# EasyEDA Pro project New Project_2025-06-11_12-14-33.eprj

# Schematic Schematic1
Board Name: Board1; Create Date: 2025-06-11; Page Name: P1; Project Name: New Project_2025-06-11_12-14-33; Schematic Name: Schematic1; Update Date: 2025-06-11; Company: EasyEDA.com; Page Size: A4; Version: V1.0
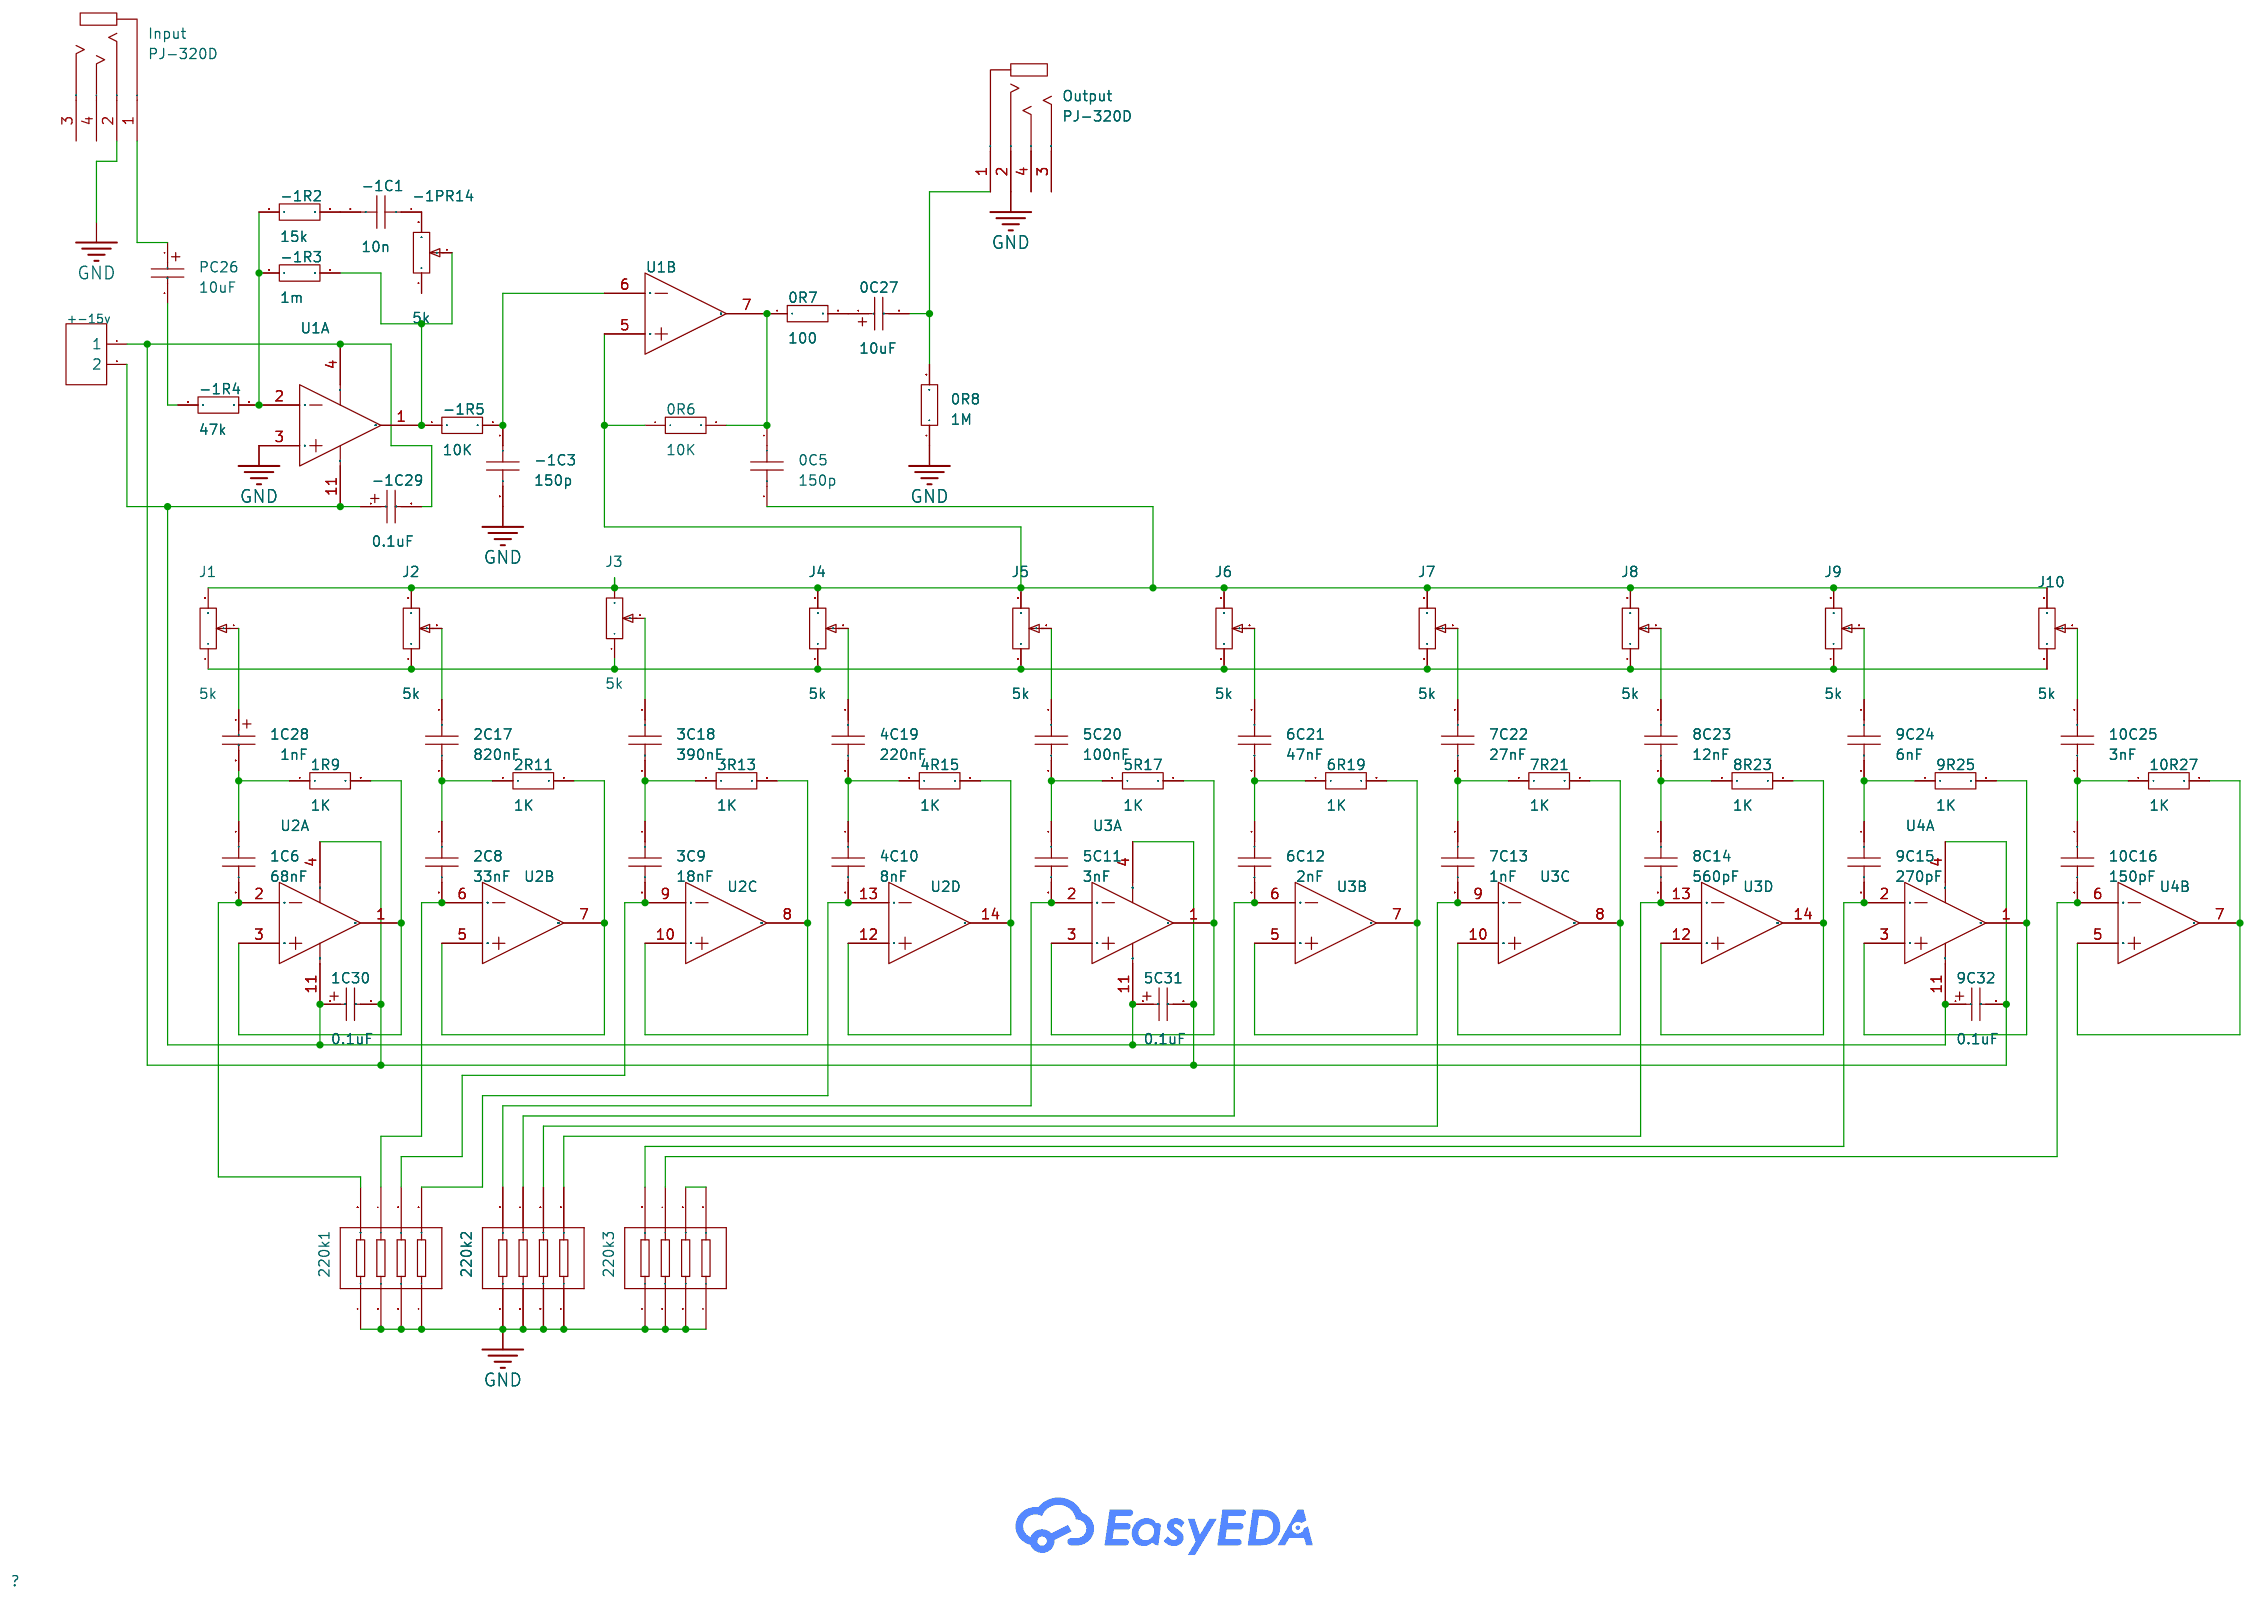
[diagram p0: schematic sheet]

## Parts
0C5  150p  [C0603]
0C27  10uF  [CAP-SMD_BD3.0-L3.3-W3.3-RD]
0R6  10K  [R0603]
0R7  100  [R0603]
0R8  1M  [R0603]
1C6  68nF  [C0603]
1C28  1nF  [CAP-SMD_BD3.0-L3.3-W3.3-RD]
1C30  0.1uF  [CAP-SMD_BD3.0-L3.3-W3.3-RD]
1R9  1K  [R0603]
2C8  33nF  [C0603]
2C17  820nF  [C0603]
2R11  1K  [R0603]
3C9  18nF  [C0603]
3C18  390nF  [C0603]
3R13  1K  [R0603]
4C10  8nF  [C0603]
4C19  220nF  [C0603]
4R15  1K  [R0603]
5C11  3nF  [C0603]
5C20  100nF  [C0603]
5C31  0.1uF  [CAP-SMD_BD3.0-L3.3-W3.3-RD]
5R17  1K  [R0603]
6C12  2nF  [C0603]
6C21  47nF  [C0603]
6R19  1K  [R0603]
7C13  1nF  [C0603]
7C22  27nF  [C0603]
7R21  1K  [R0603]
8C14  560pF  [C0603]
8C23  12nF  [C0603]
8R23  1K  [R0603]
9C15  270pF  [C0603]
9C24  6nF  [C0603]
9C32  0.1uF  [CAP-SMD_BD3.0-L3.3-W3.3-RD]
9R25  1K  [R0603]
10C16  150pF  [C0603]
10C25  3nF  [C0603]
10R27  1K  [R0603]
220k1  220K  [RES-ARRAY-SMD_0603-8P-L3.2-W1.6-BL]
220k2  220K  [RES-ARRAY-SMD_0603-8P-L3.2-W1.6-BL]
220k3  220K  [RES-ARRAY-SMD_0603-8P-L3.2-W1.6-BL]
+-15v  -  [HDR-TH_2P-P2.54-V-F]
-1C1  10n  [C0603]
-1C3  150p  [C0603]
-1C29  0.1uF  [CAP-SMD_BD3.0-L3.3-W3.3-RD]
-1PR14  5k  [RES-ADJ-TH_3P-L9.5-W9.5-P2.54-BR-BS]
-1R2  15k  [R0603]
-1R3  1m  [R0603]
-1R4  47k  [R0603]
-1R5  10K  [R0603]
Input  PJ-320D  [AUDIO-SMD_CIKI_PJ-320D_C2987375]
J1  5k  [RES-ADJ-TH_3P-L9.5-W9.5-P2.54-BR-BS]
J2  5k  [RES-ADJ-TH_3P-L9.5-W9.5-P2.54-BR-BS]
J3  5k  [RES-ADJ-TH_3P-L9.5-W9.5-P2.54-BR-BS]
J4  5k  [RES-ADJ-TH_3P-L9.5-W9.5-P2.54-BR-BS]
J5  5k  [RES-ADJ-TH_3P-L9.5-W9.5-P2.54-BR-BS]
J6  5k  [RES-ADJ-TH_3P-L9.5-W9.5-P2.54-BR-BS]
J7  5k  [RES-ADJ-TH_3P-L9.5-W9.5-P2.54-BR-BS]
J8  5k  [RES-ADJ-TH_3P-L9.5-W9.5-P2.54-BR-BS]
J9  5k  [RES-ADJ-TH_3P-L9.5-W9.5-P2.54-BR-BS]
J10  5k  [RES-ADJ-TH_3P-L9.5-W9.5-P2.54-BR-BS]
Output  PJ-320D  [AUDIO-SMD_CIKI_PJ-320D_C2987375]
PC26  10uF  [CAP-SMD_BD3.0-L3.3-W3.3-RD]
U1  -  [SOIC-14_L8.7-W3.9-P1.27-LS6.0-BL]  (sections 1,2)
U2  -  [SOIC-14_L8.7-W3.9-P1.27-LS6.0-BL]  (sections 1,2,3,4)
U3  -  [SOIC-14_L8.7-W3.9-P1.27-LS6.0-BL]  (sections 1,2,3,4)
U4  -  [SOIC-14_L8.7-W3.9-P1.27-LS6.0-BL]  (sections 1,2)

## Library data of the parts
0C5 1C6 2C8 2C17 3C9 3C18 4C10 4C19 5C11 5C20 6C12 6C21 7C13 7C22 8C14 8C23 9C15 9C24 10C16 10C25 -1C1 -1C3 = CAP_0603: Supplier Footprint: 0603
0C27 1C28 1C30 5C31 9C32 -1C29 PC26 = C_Ele_SMD_3x5.4mm: Supplier Footprint: SMD,3x5.4mm
0R6-0R8 1R9 2R11 3R13 4R15 5R17 6R19 7R21 8R23 9R25 10R27 -1R2--1R5 = Res_0603: Supplier Footprint: 0603
220k1-220k3 = 4D03WGJ0221T5E: LCSC Part Name: 220Ω ±5% 0603x4; Supplier Part: C29719; Manufacturer: UNI-ROYAL(厚声); Supplier Footprint: 0603x4; JLCPCB Part Class: Extended Part; Datasheet: https://atta.szlcsc.com/upload/public/pdf/source/20170615/1497511006024.pdf; Supplier: LCSC; Tolerance: ±5%; Temperature Coefficient: ±200ppm/℃
+-15v = HDR-F_2.54_1x2P: Supplier Footprint: Through
-1PR14 J1-J10 = R_3386P: Supplier Footprint: Through
Input Output = PJ-320D: Supplier Part: C2987375; Manufacturer: CIKI(皓富); Supplier Footprint: SMD; JLCPCB Part Class: Extended Part; Datasheet: https://atta.szlcsc.com/upload/public/pdf/source/20220407/2E28F3F967C0A65BB11D4CA4C4B2DC01.pdf; Supplier: LCSC
U1-U4 = TL074IDT: Supplier Part: C107644; Manufacturer: ST(意法半导体); Supplier Footprint: SOIC-14_150mil; JLCPCB Part Class: Extended Part; Datasheet: https://atta.szlcsc.com/upload/public/pdf/source/20170413/1492062785245.pdf; Supplier: LCSC

## Nets
GND: 0R8.1 220k1.1 220k1.2 220k1.3 220k1.4 220k2.1 220k2.2 220k2.3 220k2.4 220k3.1 220k3.2 220k3.3 220k3.4 -1C3.2 Input.2 Output.2 U1.3(1IN+)
$1N927: -1R2.1 -1R3.1 -1R4.2 U1.2(1IN-)
$1N1117: -1C1.2 -1R2.2
$1N1226: -1C1.1 -1PR14.3
$1N1231: -1PR14.2 -1R3.2 -1R5.1 U1.1(1OUT)
$1N1319: -1C3.1 -1R5.2 U1.6(2IN-)
$1N1439: 0C5.1 0R6.2 0R7.1 U1.7(2OUT)
$1N1543: 0C27.2 0R8.2 Output.1
$1N1915: 1C6.2 220k1.8 U2.2(1IN-)
$1N1941: 1C6.1 1C28.2 1R9.1
$1N1945: 1C28.1 J1.2
$1N1974: 1R9.2 U2.1(1OUT) U2.3(1IN+)
$1N2737: 2C8.2 220k1.7 U2.6(2IN-)
$1N2743: 2R11.2 U2.5(2IN+) U2.7(2OUT)
$1N2858: 3C9.2 220k1.6 U2.9(3IN-)
$1N2864: 3R13.2 U2.8(3OUT) U2.10(3IN+)
$1N2979: 4C10.2 220k1.5 U2.13(4IN-)
$1N2985: 4R15.2 U2.12(4IN+) U2.14(4OUT)
$1N3100: 5C11.2 220k2.8 U3.2(1IN-)
$1N3106: 5R17.2 U3.1(1OUT) U3.3(1IN+)
$1N4488: 6C12.2 220k2.7 U3.6(2IN-)
$1N4494: 6R19.2 U3.5(2IN+) U3.7(2OUT)
$1N4630: 7C13.2 220k2.6 U3.9(3IN-)
$1N4636: 7R21.2 U3.8(3OUT) U3.10(3IN+)
$1N4757: 8C14.2 220k2.5 U3.13(4IN-)
$1N4763: 8R23.2 U3.12(4IN+) U3.14(4OUT)
$1N4884: 9C15.2 220k3.8 U4.2(1IN-)
$1N4890: 9R25.2 U4.1(1OUT) U4.3(1IN+)
$1N5009: 10C16.2 220k3.7 U4.6(2IN-)
$1N5015: 10R27.2 U4.5(2IN+) U4.7(2OUT)
$1N5757: 2C17.1 J2.2
$1N5761: 2C8.1 2C17.2 2R11.1
$1N5788: 3C18.1 J3.2
$1N5792: 3C9.1 3C18.2 3R13.1
$1N5819: 4C19.1 J4.2
$1N5823: 4C10.1 4C19.2 4R15.1
$1N5850: 5C20.1 J5.2
$1N5854: 5C11.1 5C20.2 5R17.1
$1N5881: 6C21.1 J6.2
$1N5885: 6C12.1 6C21.2 6R19.1
$1N5912: 7C22.1 J7.2
$1N5916: 7C13.1 7C22.2 7R21.1
$1N5943: 8C23.1 J8.2
$1N5947: 8C14.1 8C23.2 8R23.1
$1N5974: 9C24.1 J9.2
$1N5978: 9C15.1 9C24.2 9R25.1
$1N6005: 10C25.1 J10.2
$1N6009: 10C16.1 10C25.2 10R27.1
$1N6083: 0C27.1 0R7.2
$1N6186: 1C30.1 5C31.1 9C32.1 +-15v.2 -1C29.1 U1.11(VCC-) U2.11(VCC-) U3.11(VCC-) U4.11(VCC-)
$1N6481: -1R4.1 PC26.2
$1N7522: 1C30.2 5C31.2 9C32.2 +-15v.1 -1C29.2 U1.4(VCC+) U2.4(VCC+) U3.4(VCC+) U4.4(VCC+)
$1N7901: Input.1 PC26.1
$1N7973: 0C5.2 0R6.1 J1.3 J2.3 J3.3 J4.3 J5.3 J6.3 J7.3 J8.3 J9.3 J10.3 U1.5(2IN+)
$1N7988: J1.1 J2.1 J3.1 J4.1 J5.1 J6.1 J7.1 J8.1 J9.1 J10.1
$1N9768: 220k3.5 220k3.6

Not connected (* = marked no-connect by the designer): -1PR14 1; Input 3 4; Output 3 4

# Board PCB1
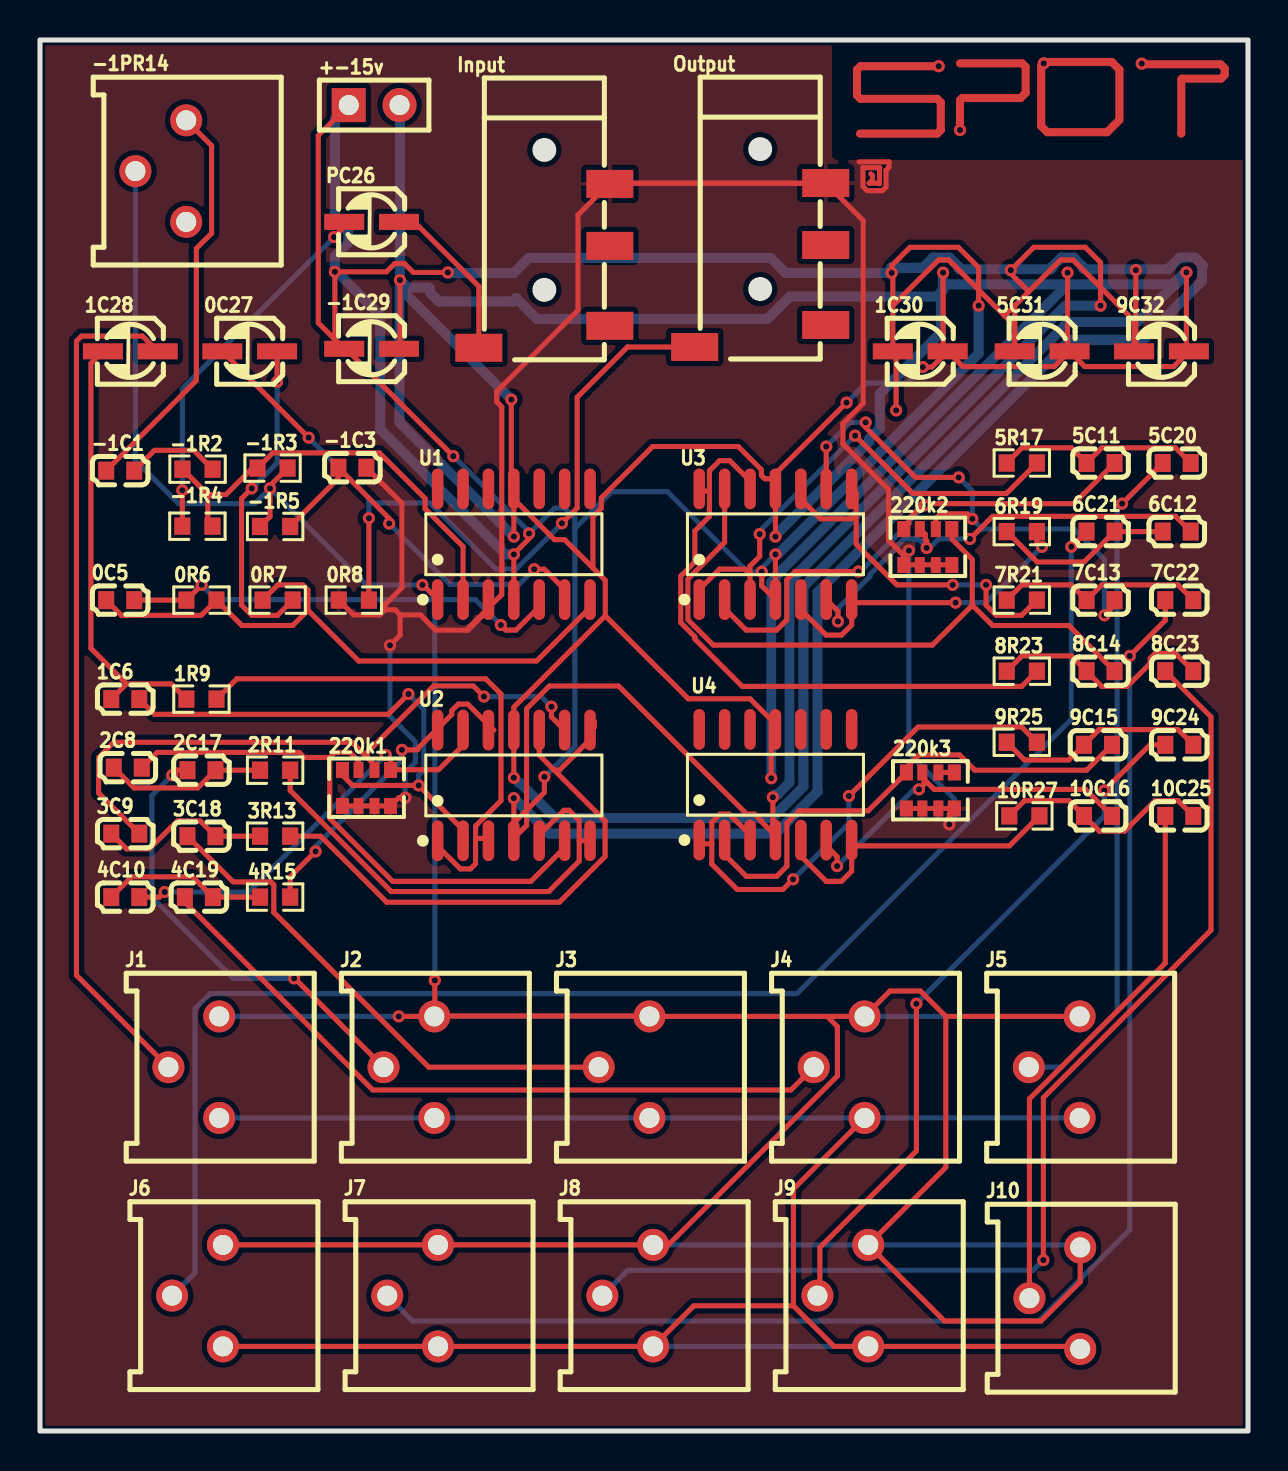
[diagram p1: board, top side]
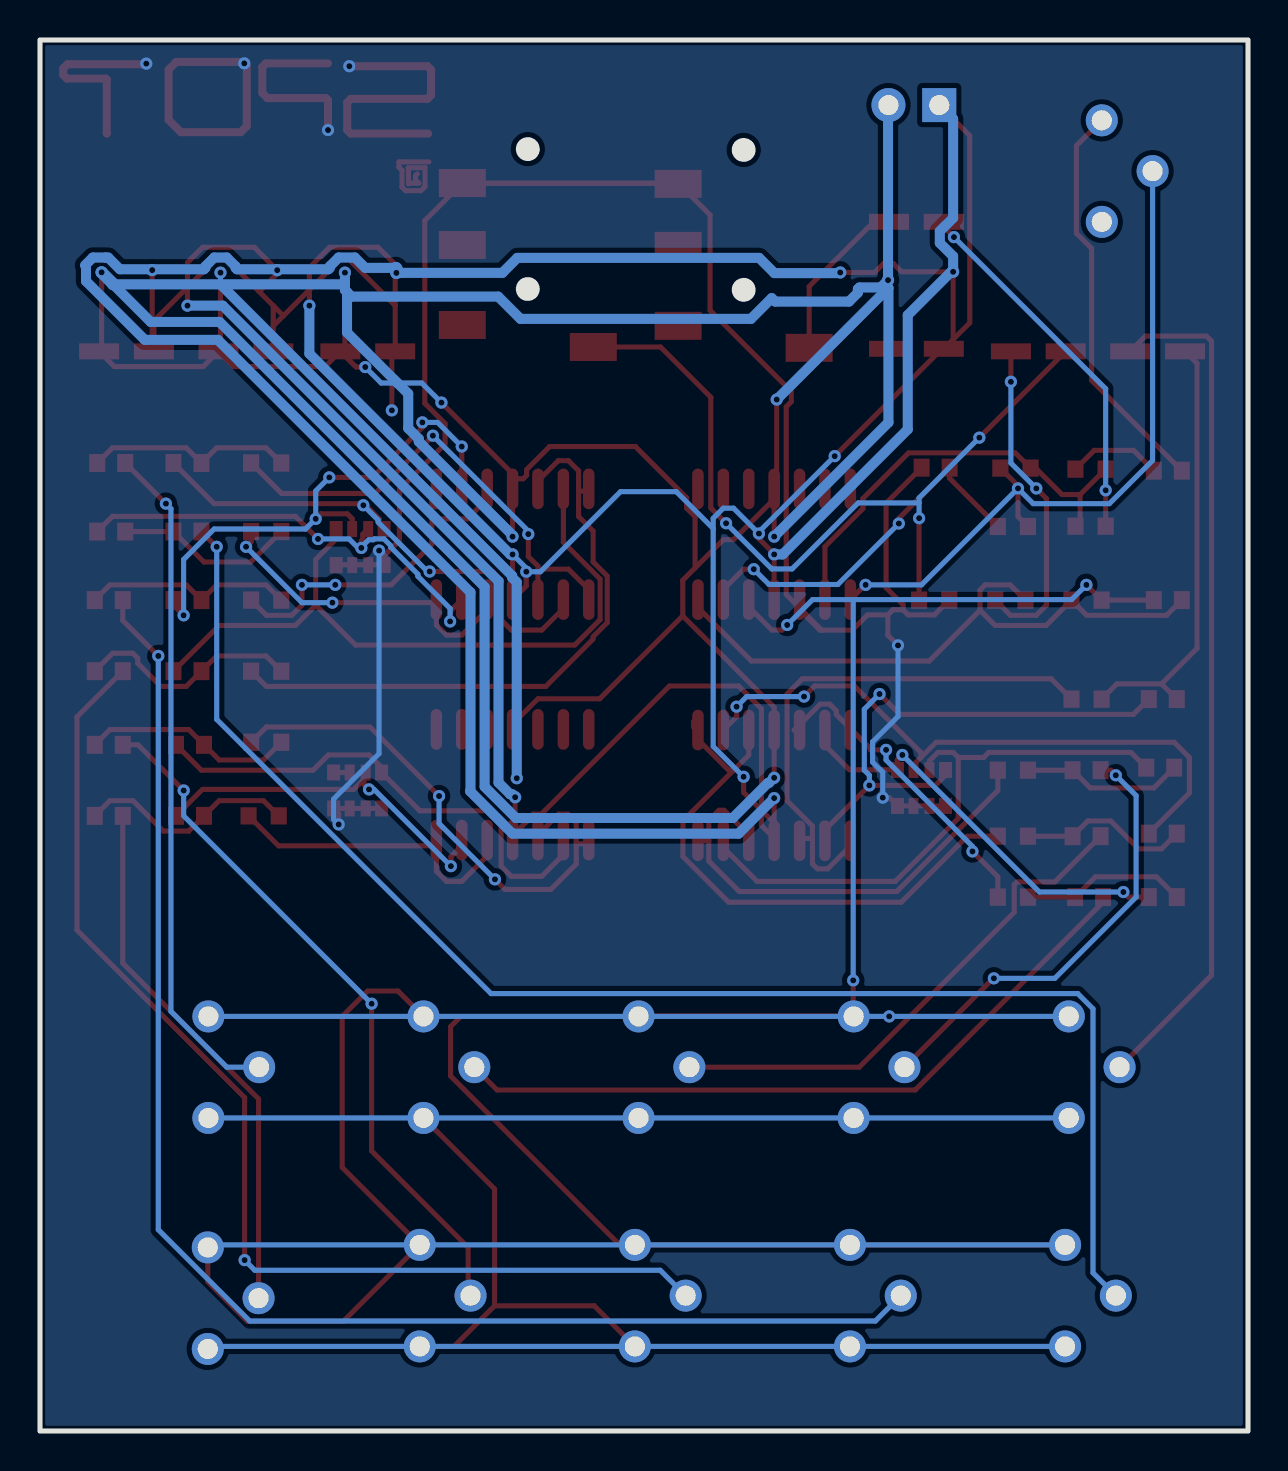
[diagram p2: board, bottom side, seen from below]

Outline 60.4 x 69.59 mm; copper layers: Top Layer, Bottom Layer. Coordinates in mm from the lower left corner of the outline.
Outline path: rectangle 0,69.59 60.4,0
Stack: Top Layer 0.035mm / Dielectric1 1.51mm FR4 er 4.5 / Bottom Layer 0.035mm

## Design rules (mm)
template: JLCPCB Capability(Two Layers Board)
spacing copperThickness1oz (default): track to track 0.102, other pairs 0.152 to 0.3
spacing copperThickness2oz: track to track 0.203, other pairs 0.152 to 0.3
track width copperThickness1oz (default): min 0.127, default 0.254, max 2.54
track width copperThickness2oz: min 0.203, default 0.254, max 2.54
differential pair differentialPair (default): width min 0.127, default 0.254, max 2.54; gap min 0.152, default 0.152
via viaSize (default): diameter min 0.5, default 0.61, max 10; hole min 0.3, default 0.305, max 6.3

## Placement (name value [footprint] x y rotation side)
0C5  150p  [C0603]  4.01 41.57 0 top
0C27  10uF  [CAP-SMD_BD3.0-L3.3-W3.3-RD]  10.49 54.02 0 top
0R6  10K  [R0603]  8.07 41.57 0 top
0R7  100  [R0603]  11.88 41.57 0 top
0R8  1M  [R0603]  15.69 41.57 0 top
1C6  68nF  [C0603]  4.26 36.62 0 top
1C28  1nF  [CAP-SMD_BD3.0-L3.3-W3.3-RD]  4.52 54.02 0 top
1C30  0.1uF  [CAP-SMD_BD3.0-L3.3-W3.3-RD]  44.01 54.02 0 top
1R9  1K  [R0603]  8.07 36.62 0 top
2C8  33nF  [C0603]  4.39 33.19 0 top
2C17  820nF  [C0603]  8.07 33.06 0 top
2R11  1K  [R0603]  11.76 33.06 0 top
3C9  18nF  [C0603]  4.26 29.89 0 top
3C18  390nF  [C0603]  8.07 29.76 0 top
3R13  1K  [R0603]  11.76 29.76 0 top
4C10  8nF  [C0603]  4.26 26.71 0 top
4C19  220nF  [C0603]  7.95 26.71 0 top
4R15  1K  [R0603]  11.76 26.71 0 top
5C11  3nF  [C0603]  53.03 48.43 0 top
5C20  100nF  [C0603]  56.84 48.43 0 top
5C31  0.1uF  [CAP-SMD_BD3.0-L3.3-W3.3-RD]  50.11 54.02 0 top
5R17  1K  [R0603]  49.09 48.43 0 top
6C12  2nF  [C0603]  56.84 45 0 top
6C21  47nF  [C0603]  53.03 45 0 top
6R19  1K  [R0603]  49.09 45 0 top
7C13  1nF  [C0603]  53.03 41.57 0 top
7C22  27nF  [C0603]  56.97 41.57 0 top
7R21  1K  [R0603]  49.09 41.57 0 top
8C14  560pF  [C0603]  53.03 38.01 0 top
8C23  12nF  [C0603]  56.97 38.01 0 top
8R23  1K  [R0603]  49.09 38.01 0 top
9C15  270pF  [C0603]  52.9 34.33 0 top
9C24  6nF  [C0603]  56.97 34.33 0 top
9C32  0.1uF  [CAP-SMD_BD3.0-L3.3-W3.3-RD]  56.08 54.02 0 top
9R25  1K  [R0603]  49.09 34.46 0 top
10C16  150pF  [C0603]  52.9 30.78 0 top
10C25  3nF  [C0603]  56.97 30.78 0 top
10R27  1K  [R0603]  49.22 30.78 0 top
220k1  220K  [RES-ARRAY-SMD_0603-8P-L3.2-W1.6-BL]  16.33 32.17 0 top
220k2  220K  [RES-ARRAY-SMD_0603-8P-L3.2-W1.6-BL]  44.4 44.22 0 top
220k3  220K  [RES-ARRAY-SMD_0603-8P-L3.2-W1.6-BL]  44.52 32.05 0 top
+-15v  -  [HDR-TH_2P-P2.54-V-F]  16.71 66.34 0 top
-1C1  10n  [C0603]  4.01 48.05 0 top
-1C3  150p  [C0603]  15.62 48.2 0 top
-1C29  0.1uF  [CAP-SMD_BD3.0-L3.3-W3.3-RD]  16.58 54.14 0 top
-1PR14  5k  [RES-ADJ-TH_3P-L9.5-W9.5-P2.54-BR-BS]  6.04 63.03 0 top
-1R2  15k  [R0603]  7.88 48.12 0 top
-1R3  1m  [R0603]  11.63 48.17 0 top
-1R4  47k  [R0603]  7.87 45.27 0 top
-1R5  10K  [R0603]  11.76 45.25 0 top
Input  PJ-320D  [AUDIO-SMD_CIKI_PJ-320D_C2987375]  25.22 58.29 0 top
J1  5k  [RES-ADJ-TH_3P-L9.5-W9.5-P2.54-BR-BS]  7.69 18.2 0 top
J2  5k  [RES-ADJ-TH_3P-L9.5-W9.5-P2.54-BR-BS]  18.45 18.2 0 top
J3  5k  [RES-ADJ-TH_3P-L9.5-W9.5-P2.54-BR-BS]  29.2 18.2 0 top
J4  5k  [RES-ADJ-TH_3P-L9.5-W9.5-P2.54-BR-BS]  39.96 18.2 0 top
J5  5k  [RES-ADJ-TH_3P-L9.5-W9.5-P2.54-BR-BS]  50.72 18.2 0 top
J6  5k  [RES-ADJ-TH_3P-L9.5-W9.5-P2.54-BR-BS]  7.88 6.77 0 top
J7  5k  [RES-ADJ-TH_3P-L9.5-W9.5-P2.54-BR-BS]  18.63 6.77 0 top
J8  5k  [RES-ADJ-TH_3P-L9.5-W9.5-P2.54-BR-BS]  29.39 6.77 0 top
J9  5k  [RES-ADJ-TH_3P-L9.5-W9.5-P2.54-BR-BS]  40.15 6.77 0 top
J10  5k  [RES-ADJ-TH_3P-L9.5-W9.5-P2.54-BR-BS]  50.75 6.65 0 top
Output  PJ-320D  [AUDIO-SMD_CIKI_PJ-320D_C2987375]  36.01 58.33 0 top
PC26  10uF  [CAP-SMD_BD3.0-L3.3-W3.3-RD]  16.58 60.49 0 top
U1  -  [SOIC-14_L8.7-W3.9-P1.27-LS6.0-BL]  23.69 44.36 0 top
U2  -  [SOIC-14_L8.7-W3.9-P1.27-LS6.0-BL]  23.69 32.3 0 top
U3  -  [SOIC-14_L8.7-W3.9-P1.27-LS6.0-BL]  36.78 44.36 0 top
U4  -  [SOIC-14_L8.7-W3.9-P1.27-LS6.0-BL]  36.78 32.33 0 top

## Footprints (pads in the part's own frame, mm; a bottom-side part is the same pattern mirrored in y, then rotated)
AUDIO-SMD_CIKI_PJ-320D_C2987375
  rect 2.35x1.4 smd: 1(-3.275,-4.1) 2(3.275,4.1) 3(3.275,1) 4(3.275,-3)
C0603
  rect 0.8x0.9 smd: 1(-0.7,0) 2(0.7,0)
CAP-SMD_BD3.0-L3.3-W3.3-RD
  rect 2x0.8 smd: 1(1.37,0) 2(-1.37,0)
HDR-TH_2P-P2.54-V-F
  rect 1.7x1.7 hole 1: 1(-1.27,0)
  round 1.7 hole 1: 2(1.27,0)
R0603
  rect 0.806x0.864 smd: 1(-0.753,0) 2(0.753,0)
RES-ADJ-TH_3P-L9.5-W9.5-P2.54-BR-BS
  round 1.6 hole 1: 1(1.27,-2.54) 2(-1.27,0) 3(1.27,2.54)
RES-ARRAY-SMD_0603-8P-L3.2-W1.6-BL
  rect 0.65x0.8 smd: 1(-1.2,-0.9) 4(1.2,-0.9) 5(1.2,0.9) 8(-1.2,0.9)
  rect 0.5x0.8 smd: 2(-0.4,-0.9) 3(0.4,-0.9) 6(0.4,0.9) 7(-0.4,0.9)
SOIC-14_L8.7-W3.9-P1.27-LS6.0-BL
  oval 0.574x2.038 smd: 1(-3.81,-2.769) 2(-2.54,-2.769) 3(-1.27,-2.769) 4(0,-2.769) 5(1.27,-2.769) 6(2.54,-2.769) 7(3.81,-2.769) 8(3.81,2.769) 9(2.54,2.769) 10(1.27,2.769) 11(0,2.769) 12(-1.27,2.769) 13(-2.54,2.769) 14(-3.81,2.769)

## Nets
As in the schematic.

Pads without a net: -1PR14 1; Input 3 4; Output 3 4; U1 8 9 10 12 13 14; U4 8 9 10 12 13 14

## Via types
v1: diameter 0.61, hole 0.305, Top Layer to Bottom Layer, 86 vias

## Routing (per net, layer and track width the routed paths; a pad name or vN(x,y) marks a point on that pad's centre or on a via; arc(x,y) is an arc through that point)
GND: length 176.4
  Top Layer w0.254: 22.42,41.18 23.09,41.85 23.09,51.24 22.84,51.5 22.84,52.01 26.9,56.07 26.9,60.84 28.49,62.43 Output.2 41.16,60.56 41.16,51.42 40.15,50.4 40.15,49.38 42.43,47.1 42.43,44.56 43.2,43.8 ; 22.42,41.18 22.42,41.08 21.41,40.07 21.31,40.07 ; 22.42,41.18 U1.3 ; 22.42,41.18 21.31,40.07 ; v1(45.47,30.35) 45.47,30.89 220k3.4 220k3.2 43.32,31.15 ; 43.2,43.8 v1(43.45,44.05) ; 43.2,43.8 43.2,43.34 45.6,43.34 ; 17.25,41.08 17.76,41.08 18.01,40.83 ; 17.25,41.08 17.25,41.34 18.1,42.19 18.1,46.42 -1C3.2 ; 17.25,41.08 16.99,40.83 15.68,40.83 0R8.1 ; v1(18.26,31.69) 17.94,31.69 17.53,31.27 220k1.3 220k1.2 220k1.1 ; 18.01,40.83 18.01,39.81 v1(17.5,39.31) ; 18.01,40.83 19.03,40.83 19.79,40.07 21.31,40.07 ; 41.54,62.9 41.63,62.81 41.63,62.6 41.46,62.43 41.95,62.43 41.98,62.4 41.98,63.19 41.99,63.2 41.17,63.2 41.15,63.21 41.15,62.26 41.36,62.05 42.12,62.05 42.3,62.23 42.3,63.07 42.46,63.23 42.46,63.48 42.44,63.5 40.96,63.5 ; 28.58,62.42 39.26,62.42
  Top Layer w0.4: 57.06,64.91 57.07,64.92 57.07,67.62 57.11,67.66 59.06,67.66 59.24,67.85 59.24,68.17 59.03,68.38 55.12,68.38 v1(55.09,68.41) ; v1(50.19,68.42) 50.06,68.3 50.06,65.28 50.37,64.98 53.36,64.98 53.97,65.6 53.97,68.11 53.59,68.49 50.26,68.49 ; v1(46,65.09) 46,66.58 46.11,66.69 49.03,66.69 49.29,66.94 49.29,68.24 49.11,68.42 46,68.42 ; v1(44.94,68.28) 41.03,68.28 40.85,68.1 40.85,66.83 41.03,66.65 44.86,66.65 45.04,66.47 45.04,65.09 44.86,64.91 41,64.91
  Bottom Layer w0.254: v1(45.47,30.35) 45.72,30.6 45.72,31.62 43.45,33.89 v1(43.45,44.05) ; v1(17.5,39.31) 17.5,35.75 18.77,34.48 18.77,33.46 18.26,32.96 v1(18.26,31.69)
$1N927: length 22
  Top Layer w0.254: -1R2.1 8.39,46.85 ; 8.39,46.85 9.3,46.85 10.62,48.17 -1R3.1 11.64,48.94 16.97,48.94 19.26,46.65 19.26,46.14 21.15,44.25 21.15,41.6 ; 8.39,46.85 8.39,45.5 -1R4.2
$1N1117: length 4.7
  Top Layer w0.254: -1C1.2 5.73,49.06 7.69,49.06 8.63,48.12
$1N1226: length 20.2
  Top Layer w0.254: -1PR14.3 8.58,64.3 8.58,59.92 7.82,59.16 7.82,52.56 -1C1.1
$1N1231: length 36.6
  Top Layer w0.254: -1R5.1 11.5,45.75 v1(11.5,47.16) 11.5,47.29 -1R3.2 ; v1(19.12,42.33) 19.15,42.33 U1.1
  Bottom Layer w0.254: -1PR14.2 4.77,48.56 6.93,46.4 10.74,46.4 v1(11.5,47.16) 16.33,42.33 v1(19.12,42.33)
$1N1319: length 19.1
  Top Layer w0.254: U1.6 26.24,42.1 25.22,43.12 v1(24.71,43.12) ; v1(17.46,45.4) 17.46,45.66 -1C3.1 14.92,47.66 -1R5.2
  Bottom Layer w0.254: v1(24.71,43.12) 23.95,42.35 20.51,42.35 v1(17.46,45.4)
$1N1439: length 31.9
  Top Layer w0.254: 13.4,41.06 13.4,42.08 13.14,42.33 11.89,42.33 0R7.1 ; 13.4,41.06 15.94,38.52 24.83,38.52 27.5,41.2 U1.7 ; 13.4,41.06 12.64,40.3 10.1,40.3 0R6.2 8.06,40.81 4.07,40.81 0C5.1
$1N1543: length 41
  Top Layer w0.254: v1(16.45,45.67) 0R8.2 ; v1(26.1,45.42) 26.86,46.18 26.86,51.72 29.38,54.23 Output.1 ; 0C27.2 v1(13.43,49.7)
  Bottom Layer w0.254: 16.45,46.43 16.45,46.69 v1(13.43,49.7) ; 16.45,46.43 19.5,46.43 22.8,43.13 23.81,43.13 v1(26.1,45.42) ; 16.45,46.43 v1(16.45,45.67)
$1N1915: length 27.2
  Top Layer w0.254: v1(18.43,36.87) 17.41,35.86 5.73,35.86 1C6.2 ; 21.15,29.53 21.15,30.08 v1(18.93,32.3) 15.63,32.3 15.13,32.8 220k1.8
  Bottom Layer w0.254: v1(18.93,32.3) 18.93,32.81 19.19,33.06 19.19,36.11 v1(18.43,36.87)
$1N1941: length 22
  Top Layer w0.254: 1C28.2 2.55,53.42 2.55,39.16 4.33,37.38 ; 1C6.1 4.33,37.38 ; 4.33,37.38 6.56,37.38 1R9.1
$1N1945: length 42.7
  Top Layer w0.254: 1C28.1 5.13,54.78 2.08,54.78 1.82,54.52 1.82,22.8 J1.2
$1N1974: length 27.4
  Top Layer w0.254: 21.78,29.65 22.31,29.65 U2.3 ; 21.78,29.65 21.78,28.38 21.53,28.12 21.02,28.12 19.88,29.26 U2.1 ; 21.78,29.65 21.78,30.27 23.05,31.54 23.05,36.87 22.29,37.63 9.84,37.63 1R9.2
$1N2737: length 29.1
  Top Layer w0.254: 220k1.7 15.93,33.53 15.5,33.95 14.74,33.95 14.49,33.7 ; 14.49,33.7 13.22,33.7 12.96,33.95 5.85,33.95 2C8.2 ; 14.49,33.7 14.49,30.65 17.64,27.5 24.55,27.5 26.23,29.19 U2.6
$1N2743: length 23.8
  Top Layer w0.254: U2.5 24.96,29.82 26.2,31.05 26.45,31.05 26.96,30.55 26.96,29.53 ; 2R11.2 12.51,32.05 17.56,26.99 25.44,26.99 26.96,28.51 26.96,29.53 ; 26.96,29.53 U2.7
$1N2858: length 32.2
  Top Layer w0.254: U2.9 25.57,35.73 v1(25.57,36.24) ; 220k1.6 16.73,33.33 16.36,33.7 ; 16.36,33.7 16.36,33.95 19.69,37.28 21.67,37.28 v1(22.2,36.74) ; 16.36,33.7 15.6,34.46 3.69,34.46 2.93,33.7 2.93,31.92 3C9.2
  Bottom Layer w0.254: v1(25.57,36.24) 25.07,36.74 v1(22.2,36.74)
$1N2864: length 28.7
  Top Layer w0.254: 27.5,34.59 25.97,33.06 25.72,33.06 ; U2.10 24.96,33.82 25.72,33.06 ; 25.72,33.06 28.26,30.52 28.26,28.74 25.97,26.46 17.34,26.46 14.03,29.76 3R13.2 ; 27.52,35.01 27.71,35.21 27.71,35.51
$1N2979: length 21
  Top Layer w0.254: v1(6.23,26.97) 5.98,26.71 4C10.2 ; 21.15,35.07 21.15,34.31 19.93,33.08 17.54,33.08 ; v1(17.29,33.82) 17.54,33.57 17.54,33.08 ; 17.54,33.08 17.53,33.07
  Bottom Layer w0.254: v1(6.23,26.97) 10.43,26.97 v1(17.29,33.82)
$1N2985: length 15.9
  Top Layer w0.254: 19.92,34.98 19.92,35.18 20.59,35.85 20.59,36.04 20.92,36.37 21.39,36.37 22.69,35.07 22.69,35.07 ; v1(18.1,34.08) 18.89,34.08 ; 18.86,34.11 19.81,35.07 ; v1(13.78,29) 12.51,27.73 4R15.2
  Bottom Layer w0.254: v1(13.78,29) 13.78,29.25 18.1,33.57 v1(18.1,34.08)
$1N3100: length 26.9
  Top Layer w0.254: 43.2,45.14 43.44,45.38 43.44,45.63 44.12,46.32 ; 44.12,46.32 44.2,46.4 51.7,46.4 5C11.2 ; 44.12,46.32 v1(44.24,46.32) ; U3.2 34.29,41.54 34.29,41.09 35.31,40.07 36.83,40.07 37.34,40.58 37.34,42.59 37.76,43 v1(40.92,43)
  Bottom Layer w0.254: v1(40.92,43) 40.99,43.07 41.1,43.07 43.49,45.47 43.49,45.57 v1(44.24,46.32)
$1N3106: length 24.9
  Top Layer w0.254: 35.51,42.87 U3.3 ; 35.51,42.87 35.51,43.27 35.99,43.76 v1(35.99,44.87) ; 35.51,42.87 35.25,43.12 33.98,43.12 32.97,42.1 U3.1 ; v1(40.76,49.8) 43.65,46.9 48.32,46.9 5R17.2
  Bottom Layer w0.254: v1(35.99,44.87) 35.99,45.03 v1(40.76,49.8)
$1N4488: length 23.4
  Top Layer w0.254: 44,45.14 44.27,44.87 44.27,44.61 44.34,44.54 v1(44.34,44.18) ; v1(39.9,40.5) 39.9,41.01 U3.6 ; 6C12.2 56.78,45.76 47.64,45.76 v1(46.5,44.63)
  Bottom Layer w0.254: v1(46.5,44.63) 44.95,44.63 44.5,44.18 v1(44.34,44.18) 44.34,44.22 43.96,44.59 43.73,44.59 43.69,44.63 43.21,44.63 42.87,44.29 42.87,44.22 41.51,42.86 41.51,42.76 39.9,41.15 v1(39.9,40.5)
$1N4494: length 16.7
  Top Layer w0.254: v1(45.78,41.44) 40.74,41.44 U3.7 40.59,40.33 40.08,39.82 39.32,39.82 38.05,41.09 U3.5 ; 6R19.2 49.85,44.49 v1(50.1,44.24)
  Bottom Layer w0.254: v1(50.1,44.24) 47.31,41.44 v1(45.78,41.44)
$1N4630: length 26.6
  Top Layer w0.254: v1(39.32,49.25) U3.9 ; v1(41.29,50.46) 41.29,50.21 43.78,47.71 v1(45.94,47.71) ; v1(46.62,45.63) 46.37,45.89 45.04,45.89 44.8,45.65 44.8,45.14 ; 7C13.2 53.73,41.32 v1(53.22,40.81)
  Bottom Layer w0.254: v1(41.29,50.46) 40.52,50.46 v1(39.32,49.25) ; v1(45.94,47.71) 46.62,47.03 v1(46.62,45.63) 47.13,45.13 51.7,45.13 53.22,43.6 v1(53.22,40.81)
$1N4636: length 18.1
  Top Layer w0.254: 40.81,45.89 40.81,44.36 42.85,42.33 v1(45.64,42.33) ; 40.81,45.89 40.56,45.63 39.04,45.63 38.05,46.63 U3.10 ; 40.81,45.89 40.81,46.9 U3.8 ; v1(47.31,42.33) 47.31,41.32 47.82,40.81 49.09,40.81 7R21.2
  Bottom Layer w0.254: v1(47.31,42.33) v1(45.64,42.33)
$1N4757: length 35.6
  Top Layer w0.254: 46.62,41.32 47.64,40.3 51.45,40.3 8C14.2 ; 46.62,41.32 46.62,43.6 45.6,44.62 45.6,45.13 45.6,45.14 ; 46.62,41.32 44.62,39.32 33.67,39.32 32.4,40.59 32.4,42.62 34.24,44.46 U3.13
$1N4763: length 31.3
  Top Layer w0.254: 8R23.2 49.09,37.25 35.12,37.25 32.75,39.62 32.75,39.74 32.04,40.44 32.04,42.77 32.75,43.48 32.75,45.03 33.47,45.75 33.47,47.02 ; 33.47,47.02 33.47,48.04 33.98,48.55 34.49,48.55 35.51,47.53 U3.12 ; 33.47,47.02 33.08,47.02 U3.14
$1N4884: length 25.2
  Top Layer w0.254: 43.44,33.06 43.44,33.32 43.95,33.82 45.98,33.82 46.75,33.06 52.33,33.06 53.6,34.33 ; 43.44,33.06 43.32,32.95 ; 43.44,33.06 41.41,31.03 37.96,31.03 37.35,30.41 37.35,28.26 36.84,27.75 35.32,27.75 34.24,28.83 34.24,29.28
$1N4890: length 27.1
  Top Layer w0.254: 35.51,29.28 35.37,29.41 35.37,29.96 34.47,30.86 34,30.86 33.59,30.45 33.59,29.38 ; v1(37.66,27.6) 37.15,27.09 34.86,27.09 33.59,28.36 33.59,29.38 ; 33.59,29.38 33.07,29.38 32.97,29.28 ; 9R25.2 49.09,35.22 43.9,35.22 v1(40.45,31.77)
  Bottom Layer w0.254: v1(37.66,27.6) 40.45,30.39 v1(40.45,31.77)
$1N5009: length 18.1
  Top Layer w0.254: 44.21,32.61 44.21,32.35 v1(43.95,32.1) ; 44.21,32.61 44.71,32.1 52.28,32.1 53.6,30.78 ; 44.21,32.61 44.21,32.86 220k3.7 ; v1(39.86,28.26) 39.86,28.73 39.32,29.28
  Bottom Layer w0.254: v1(39.86,28.26) 43.7,32.1 v1(43.95,32.1)
$1N5015: length 15.1
  Top Layer w0.254: 38.05,29.28 38.05,28.77 39.32,27.5 40.08,27.5 40.59,28.01 40.59,29.28 48.48,29.28 10R27.2
$1N5757: length 22.5
  Top Layer w0.254: v1(12.71,22.65) 12.73,22.65 J2.2 ; 2C17.1 6.87,33.06 v1(6.61,32.81)
  Bottom Layer w0.254: v1(6.61,32.81) 5.6,31.79 5.6,26.71 9.66,22.65 v1(12.71,22.65)
$1N5761: length 8.1
  Top Layer w0.254: 2C8.1 4.71,32.17 7.88,32.17 2C17.2 2R11.1
$1N5788: length 26.2
  Top Layer w0.254: J3.2 19.44,18.2 11.69,25.95 11.69,27.33 11.54,27.47 9.66,27.47 3C18.1
$1N5792: length 8.6
  Top Layer w0.254: 3R13.1 3C18.2 8.01,30.52 6.87,30.52 5.47,29.12 4.33,29.12 3C9.1
$1N5819: length 36.1
  Top Layer w0.254: J4.2 37.55,17.06 16.64,17.06 7.25,26.46 4C19.1
$1N5823: length 8.3
  Top Layer w0.254: 4C10.1 4.58,27.73 7.63,27.73 8.65,26.71 4R15.1
$1N5850: length 33.9
  Top Layer w0.254: 5C20.1 v1(54.11,46.4)
  Bottom Layer w0.254: v1(54.11,46.4) 53.86,46.14 53.86,21 51.06,18.2 J5.2
$1N5854: length 10.5
  Top Layer w0.254: 5C20.2 56.78,49.19 53.09,49.19 5C11.1 51.57,49.19 49.1,49.19 5R17.1
$1N5881: length 74.4
  Top Layer w0.254: 6C21.1 v1(51.57,44.24)
  Bottom Layer w0.254: v1(51.57,44.24) 51.57,35.6 37.85,21.89 8.51,21.89 7.75,21.12 7.75,7.92 J6.2
$1N5885: length 9.1
  Top Layer w0.254: 6R19.1 49.87,43.48 52.21,43.48 6C21.2 6C12.1
$1N5912: length 71.8
  Top Layer w0.254: 7C22.1 56.27,40.55 v1(54.49,38.78)
  Bottom Layer w0.254: v1(54.49,38.78) 54.49,10.07 49.92,5.5 18.63,5.5 J7.2
$1N5916: length 10.6
  Top Layer w0.254: 7R21.1 49.1,42.33 51.57,42.33 7C13.1 53.09,42.33 56.91,42.33 7C22.2
$1N5943: length 56.7
  Top Layer w0.254: 8C23.1 58.55,35.73 58.55,25.06 50.17,16.68 v1(50.17,8.55)
  Bottom Layer w0.254: v1(50.17,8.55) 49.66,8.04 29.39,8.04 J8.2
$1N5947: length 11.5
  Top Layer w0.254: 8C23.2 56.77,38.91 55.77,38.91 55.52,38.66 55.52,38.4 54.36,37.25 53.09,37.25 8C14.1 51.57,38.78 49.1,38.78 8R23.1
$1N5974: length 35.2
  Top Layer w0.254: J9.2 39,6.89 39,9.19 43.82,14.01 v1(43.82,21.38) ; v1(53.22,32.05) 55.51,34.33 9C24.1
  Bottom Layer w0.254: v1(53.22,32.05) 53.22,30.78 v1(43.82,21.38)
$1N5978: length 10.6
  Top Layer w0.254: 9C24.2 56.91,35.09 52.97,35.09 9C15.1 51.44,33.57 49.23,33.57 9R25.1
$1N6005: length 26.9
  Top Layer w0.254: 10C25.1 56.27,23.41 49.48,16.62 J10.2
$1N6009: length 11.1
  Top Layer w0.254: 10R27.1 49.23,31.54 51.44,31.54 10C16.1 52.97,30.01 54.24,30.01 55.76,31.54 56.91,31.54 10C25.2
$1N6083: length 16.5
  Top Layer w0.254: 0R7.2 11.88,40.81 10.59,40.81 10.08,41.32 10.08,46.65 v1(10.59,47.16) ; 0C27.1 v1(11.86,52.49)
  Bottom Layer w0.254: v1(10.59,47.16) 11.86,48.43 v1(11.86,52.49)
$1N6186: length 267.2
  Top Layer w0.254: v1(36.78,44.75) U3.11 36.78,47.64 ; v1(45.16,57.95) 45.16,54.24 1C30.1 ; 23.69,46.63 U1.11 23.57,47.26 v1(23.57,51.6) ; 23.69,46.63 25.73,44.59 26.23,44.59 27.65,43.18 ; 23.69,46.63 v1(23.69,44.75) ; 1C30.1 46.15,53.25 50.72,53.25 5C31.1 ; 1C30.1 44.6,53.23 v1(44.14,53.23) ; 36.78,47.64 36.78,47.9 v1(40.33,51.45) ; 36.78,47.64 36.24,47.64 36.07,47.81 36.07,48.1 34.92,49.25 30.63,49.25 28.07,46.69 28.07,46.17 27.65,45.74 27.65,43.18 ; v1(51.38,57.95) 51.38,54.12 5C31.1 ; v1(18,57.58) 18,54.19 -1C29.1 ; v1(23.69,32.68) U2.11 23.69,36.21 28.27,40.78 ; 27.65,43.18 28.27,42.56 28.27,40.78 ; v1(57.32,57.97) 57.32,54.14 9C32.1 56.69,53.25 52.24,53.25 5C31.1 ; 28.27,40.78 32.42,36.63 35.51,36.63 36.56,35.58 v1(36.56,32.66)
  Bottom Layer w0.254: v1(40.33,51.45) 40.34,51.45 41.32,52.43 43.34,52.43 v1(44.14,53.23) ; 45.16,57.7 v1(45.16,57.95) ; 51.38,57.37 v1(51.38,57.95)
  Bottom Layer w0.5: 51.38,57.37 56.75,57.37 54.87,55.49 51.43,55.49 38.17,42.23 38.17,32.24 36.6,30.67 25.76,30.67 24.01,32.42 23.95,32.42 v1(23.69,32.68) ; 51.38,57.37 45.16,57.37 ; 51.38,57.37 36.8,42.79 36.8,42.7 36.56,42.47 v1(36.56,32.66) ; 45.05,56.98 45.16,57.08 45.16,57.37 ; 45.05,56.98 45.05,54.96 42.53,52.43 41.99,51.9 41.99,50.17 41.47,49.64 41.47,49.5 36.78,44.81 v1(36.78,44.75) ; 45.05,56.98 44.83,56.75 37.49,56.75 36.38,55.64 24.85,55.64 23.82,56.68 23.64,56.51 19.95,56.51 19.51,56.95 19.51,57.13 19.43,57.21 18.37,57.21 v1(18,57.58) 18,66.31 +-15v.2 ; v1(23.69,44.75) 17.98,50.46 17.98,57.19 v1(23.57,51.6) ; 45.16,57.37 45.16,57.7
  Bottom Layer w0.6: v1(57.32,57.97) 56.75,57.39 56.75,57.37
$1N6481: length 18.6
  Top Layer w0.254: 15.21,60.49 15.21,60.24 v1(14.7,59.73) ; v1(7.12,47.06) -1R4.1
  Bottom Layer w0.254: v1(14.7,59.73) 7.12,52.14 v1(7.12,47.06)
$1N7522: length 321.5
  Top Layer w0.254: v1(54.8,58.08) 54.8,54.1 9C32.2 54.71,55.54 53.03,57.22 ; v1(36.65,31.71) 36.65,29.92 ; 36.65,29.92 36.07,30.49 36.07,30.53 35.74,30.86 35.34,30.86 28.93,37.27 25.47,37.27 24.33,36.13 24.33,31.06 ; 36.65,29.92 36.78,29.79 36.78,29.28 ; 46.94,57.09 46.94,58.21 45.92,59.22 43.51,59.22 42.58,58.3 v1(42.58,57.94) 42.64,57.88 42.64,56.3 ; 46.94,57.09 v1(46.94,56.3) ; 46.94,57.09 48.23,55.79 ; 46.94,57.09 45.44,58.59 44.93,58.59 42.64,56.3 ; v1(25.22,32.73) 25.22,31.95 24.33,31.06 ; 14.75,54.61 v1(14.75,58) 17.32,58 17.74,58.41 18.22,58.41 18.67,57.96 v1(20.39,57.96) ; 14.75,54.61 15.21,54.14 15.3,54.14 v1(20.67,48.77) ; 14.75,54.61 13.92,55.44 13.92,64.81 +-15v.1 ; 48.74,56.3 49.44,57 ; 48.74,56.3 48.74,55.29 ; 48.74,56.3 48.23,55.79 ; 49.44,57 51.03,58.59 51.66,58.59 53.03,57.22 ; 49.44,57 48.54,57.9 v1(48.54,58.08) 49.69,59.22 52.27,59.22 53.03,58.46 53.03,57.22 ; 24.33,31.06 23.69,30.42 ; 24.33,31.06 24.33,30.3 23.69,29.66 ; 23.69,30.42 v1(23.69,31.66) ; 23.69,30.42 23.69,29.66 ; v1(24.46,44.9) 24.46,44.65 23.69,43.88 U1.4 ; 42.64,56.3 1C30.2 42.81,53.85 42.81,51.1 ; v1(36.78,43.86) U3.4 36.09,42.28 v1(36.09,42.99) ; 53.03,57.22 v1(53.03,56.3) ; U2.4 23.69,29.66 ; 48.23,55.79 48.74,55.29 ; 48.74,55.29 5C31.2 ; 42.77,51.1 42.83,51.04
  Bottom Layer w0.254: v1(25.22,32.73) 26.74,34.25 26.74,45.15 ; v1(20.67,48.77) 24.46,44.98 v1(24.46,44.9) 25.73,46.17 26.23,46.17 26.74,45.66 26.74,45.15 ; 26.74,45.15 28.59,47 31.37,47 35.38,42.99 v1(36.09,42.99) 36.09,43.17 v1(36.78,43.86)
  Bottom Layer w0.5: v1(23.69,43.86) 23.27,43.86 17.01,50.11 17.01,55.83 14.85,58 v1(14.75,58) 14.75,58.77 15.41,59.44 15.41,60.02 14.75,60.69 14.75,65.64 +-15v.1 ; v1(53.03,56.3) 51.27,56.3 37.48,42.51 37.48,32.44 36.89,31.85 36.79,31.85 v1(36.65,31.71) ; 42.61,58.19 44.14,58.19 44.66,58.71 45.47,58.71 45.91,58.27 45.91,58.19 45.98,58.12 48.5,58.12 v1(48.54,58.08) 48.59,58.12 50.55,58.12 50.62,58.19 50.62,58.27 51.07,58.71 51.69,58.71 52.14,58.27 52.14,58.19 52.21,58.12 54.75,58.12 v1(54.8,58.08) 54.84,58.12 56.41,58.12 56.99,58.71 57.13,58.71 57.14,58.71 57.76,58.71 58.16,58.32 ; v1(46.94,56.3) 46.94,53.9 36.89,43.86 36.87,43.86 ; 42.58,58.17 42.36,57.94 37.28,57.94 36.54,58.69 24.44,58.69 23.68,57.93 20.42,57.93 v1(20.39,57.96) ; v1(23.69,31.66) 25.47,29.89 36.78,29.89 38.9,32.01 38.88,32.03 38.88,41.96 51.51,54.59 55.17,54.59 58.1,57.53 58.1,58.18
  Bottom Layer w0.6: v1(42.58,57.94) 42.58,58.17 42.61,58.19
  vias: v1(42.81,51.06)
$1N7901: length 8.4
  Top Layer w0.254: PC26.1 18.71,60.49 21.94,57.26 21.94,54.23
$1N7973: length 229.5
  Top Layer w0.254: 39.36,20.74 J4.3 42.5,22.01 44.02,22.01 45.29,20.74 ; 39.36,20.74 J3.3 30.45,20.77 19.74,20.77 ; 39.36,20.74 39.87,20.23 39.87,17.76 31.42,9.31 J8.3 J7.3 J6.3 ; 0C5.2 0R6.1 v1(8.08,42.33) ; 45.29,20.74 J5.3 ; 45.29,20.74 45.29,13.19 J9.3 45.23,5.5 50.05,5.5 52.02,7.47 J10.3 ; U1.5 24.96,41.23 23.81,40.07 23.3,40.07 v1(23.04,40.33) ; v1(17.94,20.74) J2.3 19.74,20.77 ; 19.74,20.77 v1(19.74,22.55)
  Bottom Layer w0.254: J1.3 v1(17.94,20.74) J2.3 J3.3 J4.3 J5.3 ; v1(8.08,42.33) 8.82,41.6 19.74,41.6 ; 19.74,41.6 21.77,41.6 v1(23.04,40.33) ; 19.74,41.6 v1(19.74,22.55) ; 52.17,9.31 J9.3 J8.3 J7.3 J6.3
$1N7988: length 141.5
  Top Layer w0.254: J4.1 37.67,12.11 37.67,6.26 ; J6.1 J7.1 J8.1 32.69,6.26 37.67,6.26 ; J10.1 51.89,4.23 J9.1 39.71,4.23 37.67,6.26
  Bottom Layer w0.254: 52.17,4.23 J9.1 J8.1 J7.1 J6.1 ; J1.1 J2.1 J3.1 J4.1 J5.1
$1N9768: length 0.8
  Top Layer w0.254: 220k3.5 44.92,32.95

## Copper pours and planes (outline as drawn; the poured copper is in the pictures)
GND on Top Layer: 0.1,69.45 60.31,69.45 60.31,0.14 0.1,0.14
GND on Bottom Layer: -0.06,69.72 60.31,69.72 60.31,0.08 -0.06,0.08
(no net) on Top Layer: 39.73,69.29 60.16,69.29 60.16,63.7 39.73,63.7

Small or netless copper shapes (teardrops, artwork), in the pictures only: 2 on Top Layer
